# Altium project actuators-2.PrjPcb
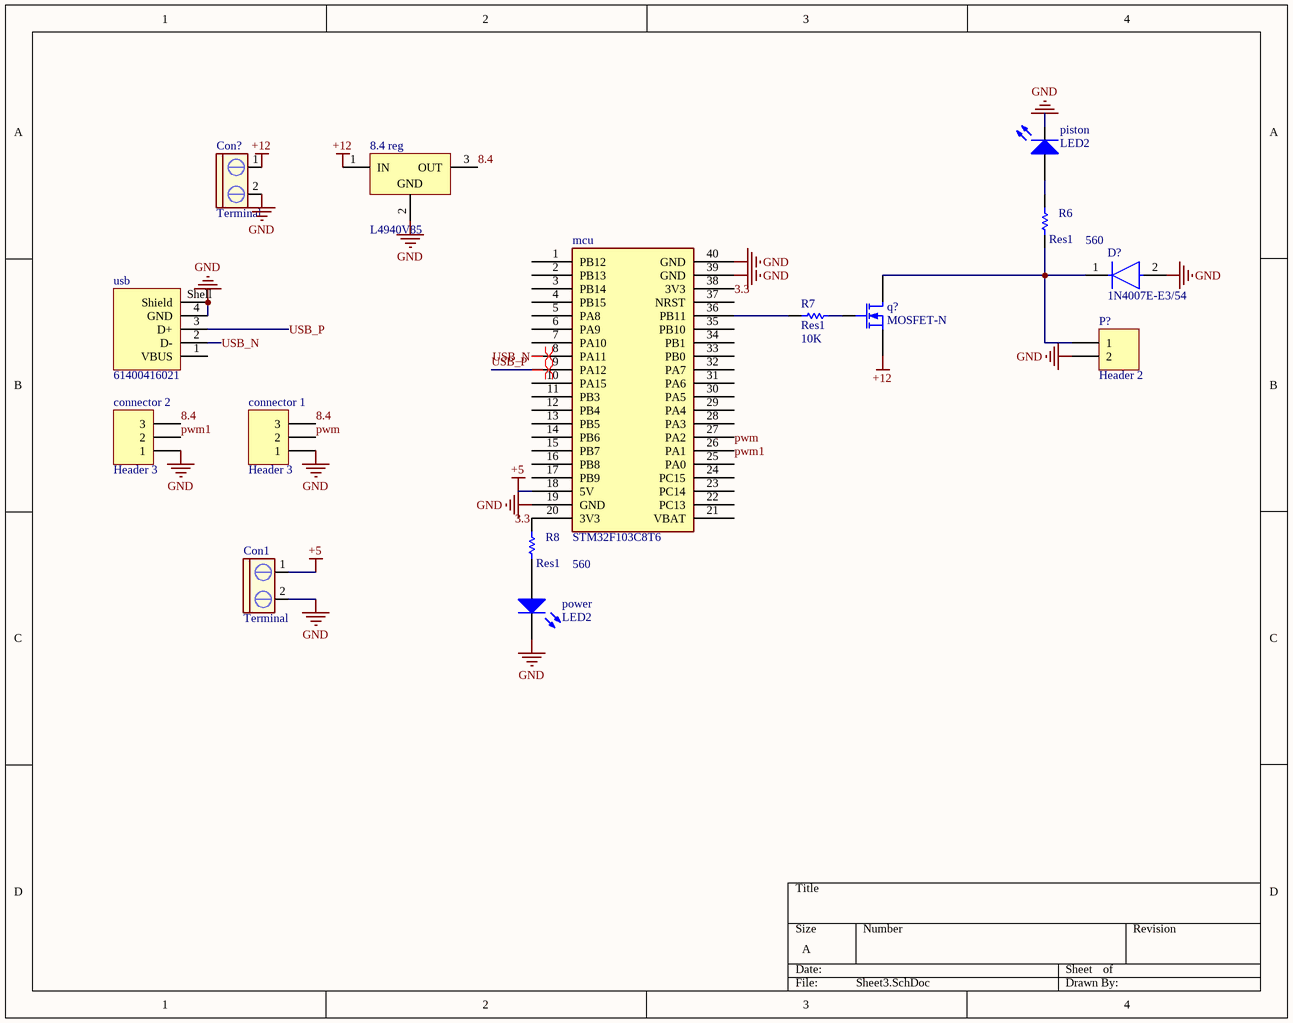
[diagram p0: Sheet3.SchDoc]
1 sheet, 15 parts. Net scope: global (net labels, ports and power ports of the same name join across sheets).
Board file: PCB1 (1).PcbDoc

## Sheet Sheet3.SchDoc
size A; SheetNumber: 1; SheetTotal: 1; SPICEModelCacheSPCDLQCX: <root> / <DocumentId>SPCDLQCX</DocumentId> / <CacheFrame Number="0"> / <Model Name="nmos" Kind="MDL"> / <Text>*Default N-Channel MOSFET / *Pinout: D,G,S / .MODEL NMOS NMOS()</Text> / </Model> / <Model Name="led2" Kind="MDL"> / <Text>*Typ RED,GREEN,YELLOW,AMBER GaAs LED: Vf=2.1V Vr=4V If=40mA trr=3uS / *LED Pinout: 1=A, 2=K / .MODEL LED2 D (IS=93.1P RS=42M N=4.61 BV=4 IBV=10U / + CJO=2.97P VJ=.75 M=.333 TT=4.32U)</Text> / </Model> / </CacheFrame> / </root>

### Parts
8.4_reg  L4940V85  [TO220]
Con1  Terminal  [Terminal Block 2 Pin]
Con?  Terminal  [Terminal Block 2 Pin]
connector_1  Header 3  [HDR1X3]
connector_2  Header 3  [HDR1X3]
D?  1N4007E-E3/54  [FP-1N4007E-E3-54-MFG]
mcu  STM32F103C8T6  [Stm32 BluePill]
P?  Header 2  [HDR1X2]
piston  LED2  [3.2X1.6X1.1]
power  LED2  [3.2X1.6X1.1]
q?  MOSFET-N  [E3]
R6  Res1  value 560  [AXIAL-0.3]
R7  Res1  value 10K  [AXIAL-0.3]
R8  Res1  value 560  [AXIAL-0.3]
usb  61400416021  [61400416021]

### Nets
+5: Con1.1 mcu.18(5V)
+12: 8.4_reg.1(IN) Con?.1 q?.3(S)
GND: 8.4_reg.2(GND) Con1.2 Con?.2 connector_1.1 connector_2.1 D?.2(A) mcu.19(GND) mcu.39(GND) mcu.40(GND) P?.2 piston.2(K) power.2(K) usb.4(GND) usb.Shell(Shield)
3.3: mcu.20(3V3) mcu.38(3V3) R8.2
8.4: 8.4_reg.3(OUT) connector_1.3 connector_2.3
pwm: connector_1.2 mcu.27(PA2)
pwm1: connector_2.2 mcu.26(PA1)
USB_N: mcu.8(PA11) usb.2(D-)
USB_P: mcu.9(PA12) usb.3(D+)
NetD?_1: D?.1(C) P?.1 q?.1(D) R6.1
Netmcu_36: mcu.36(PB11) R7.1
Netpiston_1: piston.1(A) R6.2
Netpower_1: power.1(A) R8.1
Netq?_2: q?.2(G) R7.2

Not connected (* = marked no-connect by the designer): mcu 1(PB12) 2(PB13) 3(PB14) 4(PB15) 5(PA8) 6(PA9) 7(PA10) 10(PA15) 11(PB3) 12(PB4) 13(PB5) 14(PB6) 15(PB7) 16(PB8) 17(PB9) 21(VBAT) 22(PC13) 23(PC14) 24(PC15) 25(PA0) 28(PA3) 29(PA4) 30(PA5) 31(PA6) 32(PA7) 33(PB0) 34(PB1) 35(PB10) 37(NRST); usb 1(VBUS)

### Layout directives
differential pair: USB_N, USB_P

### Library data of the parts
8.4_reg = CMP-0244-00412-1: 1.5A Very Low Drop Regulator, 3-Pin TO-220; ComponentLink3URL: http://www.st.com/internet/com/TECHNICAL_RESOURCES/TECHNICAL_LITERATURE/PACKAGE_INFORMATION/CD00004649.pdf; ComponentLink1Description: Manufacturer URL; PackageReference: TO220; ComponentLink2URL: http://www.st.com/internet/com/TECHNICAL_RESOURCES/TECHNICAL_LITERATURE/DATASHEET/CD00000442.pdf; DatasheetVersion: 16/12/2009; PackageDescription: TO, Thru-Hole, Vertical, Heatsink Mounted; 3 In-Line Leads; Pitch 2.54 mm; ComponentLink2Description: Datasheet; PackageVersion: ver3.0; ComponentLink1URL: http://www.st.com; ComponentLink3Description: Package Specification
Con1 Con? = Terminal Block 2: Connector blue screw
connector_1 connector_2 = Header 3: Header, 3-Pin; LatestRevisionDate: 17-Jul-2002; LatestRevisionNote: Re-released for DXP Platform.; Publisher: Altium Limited
D? = CMP-02540-000087-1: DIODE GEN PURP 1KV 1A DO204AL; Peak Non-Repetitive Surge Current: 45A; Forward Voltage: 1.1V; Element Configuration: Single; Max Reverse Current: 5uA; Max Repetitive Reverse Voltage (Vrrm): 1kV; RoHS Compliant: Yes; Max Surge Current: 45A; Min Operating Temperature: -50°C; Radiation Hardening: No; Average Rectified Current: 1A; Series: -; Packaging: Tape and Reel; Contact Plating: Tin; Package Quantity: 5500; Max Reverse Voltage (DC): 1kV; Reverse Voltage: 1kV; Number of Pins: 2; Max Operating Temperature: 150°C; Case/Package: DO-41; Mount: Through Hole
mcu = BluePill: Designed By @Alixahedi
P? = Header 2: Header, 2-Pin; LatestRevisionDate: 17-Jul-2002; LatestRevisionNote: Re-released for DXP Platform.; Publisher: Altium Limited
piston power = LED2: Typical RED, GREEN, YELLOW, AMBER GaAs LED; Published: 8-Jun-2000; LatestRevisionDate: 17-Jul-2002; LatestRevisionNote: Re-released for DXP Platform.; PackageVersion: Feb-2002; PackageReference: 3.2X1.6X1.1; Publisher: Altium Limited; PackageDescription: SM LED; 2 Flat Leads
q? = MOSFET-N: N-Channel MOSFET; Published: 8-Jun-2000; LatestRevisionDate: 17-Jul-2002; LatestRevisionNote: Re-released for DXP Platform.; PackageVersion: 1995/1996; PackageReference: E3; Publisher: Altium Limited; PackageDescription: TO, Flat Index; 3 In-Line, Axial Leads; Body Dia. 4.6mm; Lead Dia. 0.5 mm (max)
R6-R8 = Res1: Resistor; Published: 8-Jun-2000; LatestRevisionDate: 17-Jul-2002; LatestRevisionNote: Re-released for DXP Platform.; PackageReference: AXIAL-0.3; Publisher: Altium Limited; PackageDescription: Axial Device, Thru-Hole; 2 Leads; 0.3 in Pin Spacing
usb = CMP-1502-03227-2: NexarPartId: 21041530; Contact Resistance: 20mΩ; Gender: Receptacle; Voltage Rating (DC): 30V; Current Rating: 1.5A; Connector Type: USB; Insulation Resistance: 1GΩ; USB Standard: USB 2.0; Number of Contacts: 4; Number of Ports: 1; Width: 14.4mm; REACH SVHC: Unknown; Contact Plating: Gold; Length: 15.8mm; Lead Free: Lead Free; Max Operating Temperature: 105°C; Orientation: Horizontal; Contact Material: Copper; Voltage Rating: 30V; Min Operating Temperature: -40°C; Flammability Rating: UL94 V-0; Color: White; RoHS: Compliant; Number of Pins: 4; Mount: Horizontal, Through Hole; Number of Positions: 4; Operating Supply Voltage: 30V; Insulation Material: PBT; Termination: Solder